# EAGLE design rocketSoldering (EAGLE 7.3.0)
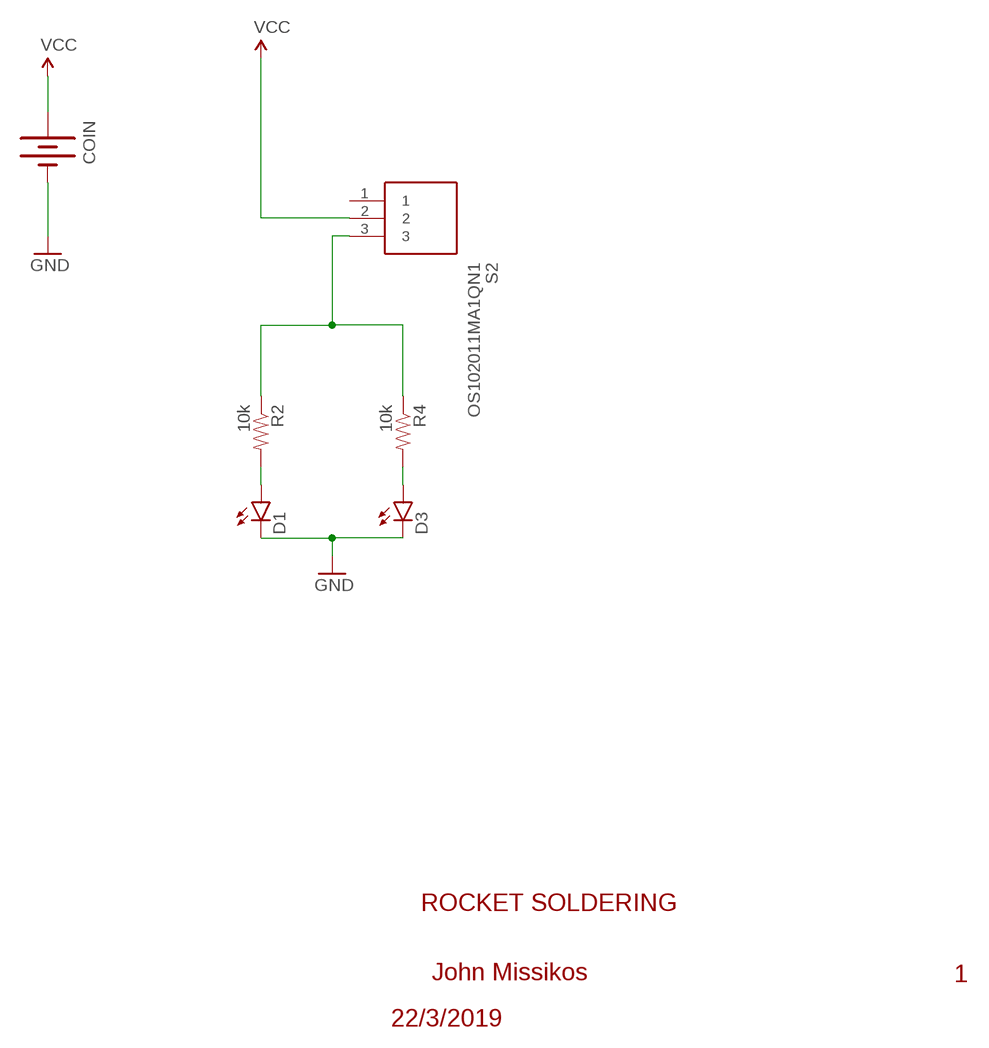
[diagram p0: schematic, sheet 1]

## Parts
COIN  BATTERY_20MM20PTH  [BATTCOM_20MM_PTH]
D1  LED5MM  [LED5MM]
D3  LED5MM  [LED5MM]
R2  10k  RESISTORAXIAL-0.3  [AXIAL-0.3]
R4  10k  RESISTORAXIAL-0.3  [AXIAL-0.3]
S2  OS102011MA1QN1  [OS102011MA1QN1]

## Nets
GND: COIN.2(-) D1.K(C) D3.K(C)
N$1: D1.A R2.P$2
N$2: R2.P$1 R4.P$1 S2.3
N$5: D3.A R4.P$2
VCC: COIN.1(+) S2.2
Unconnected: S2.1

## Notes on the sheet
- ROCKET SOLDERING
- John Missikos | 1
- 22/3/2019

## Library data of the parts
COIN = TinkerElectric:BATTERY_20MM: Battery Holders Various common sizes : AA, AAA, 18650 (PRT-12895), 20mm coin cell and 12mm coin cell. 20MM_4LEGS, BATT-10373
D1 D3 = SparkFun-LED:LED: LEDs Standard schematic elements and footprints for 5mm, 3mm, 1206, and 0603 sized LEDs. 5mm - Spark Fun Electronics SKU : COM-00529 (and others)
R2 R4 = SparkFun-Passives:RESISTOR: Resistor Basic schematic elements and footprints for 0603, 1206, and PTH resistors.
S2 = TinkerElectric:OS102011MA1QN1: Switch Slide Right Angle SPDT 0.1A 12VDC Through Hole Slide Switch SPDT On-On 0.1 A@ 12 V dc Slide Source: Datasheet <http://www.ckswitches.com/media/1428/os.pdf>; ALLIED_NUMBER: 70128246; ALLIED_PRICE-STOCK: https://www.alliedelec.com/c-k-os102011ma1qn1/70128246/; DESCRIPTION: Switch Slide Right Angle SPDT 0.1A 12VDC Through Hole Slide Switch SPDT On-On 0.1 A@ 12 V dc Slide; HEIGHT: mm; MANUFACTURER_NAME: C & K COMPONENTS; MANUFACTURER_PART_NUMBER: OS102011MA1QN1; MOUSER_PART_NUMBER: 611-OS102011MA1QN1; MOUSER_PRICE-STOCK: https://www.mouser.com/Search/Refine.aspx?Keyword=611-OS102011MA1QN1; RS_PART_NUMBER: 7874855; RS_PRICE-STOCK: http://uk.rs-online.com/web/p/products/7874855

## Board
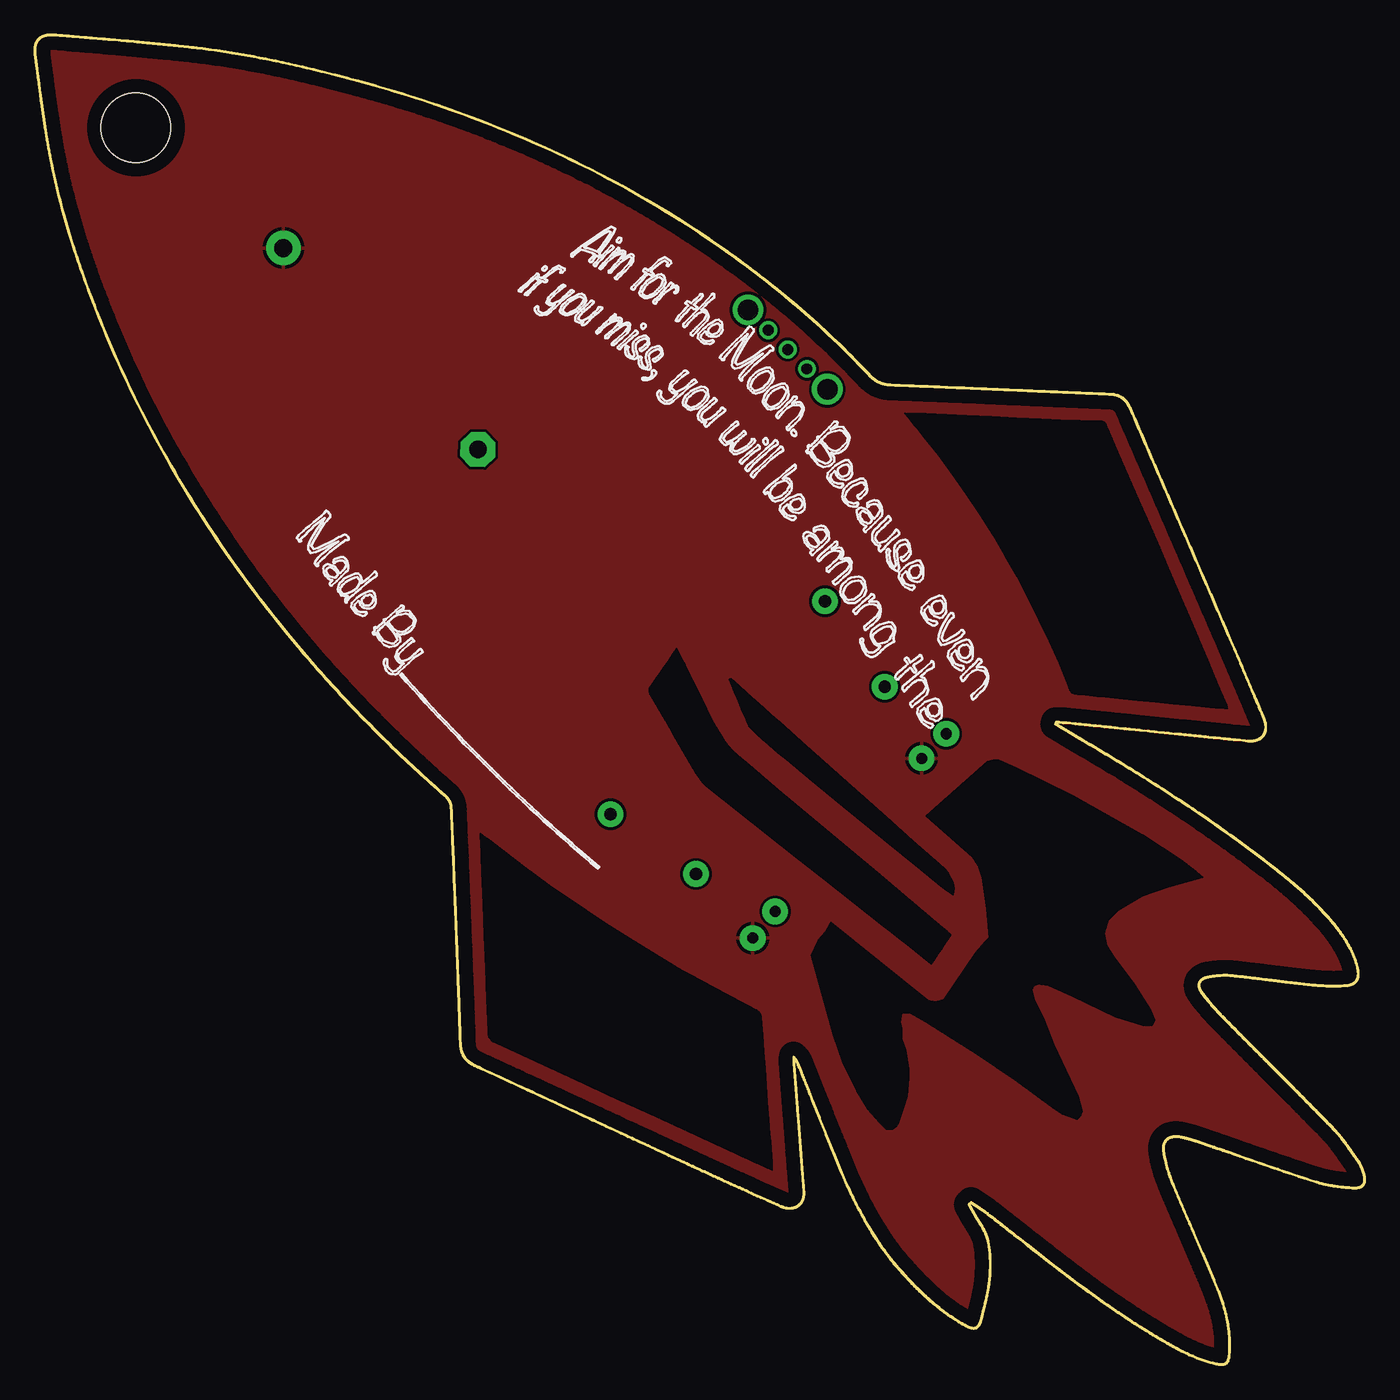
[diagram p1: board, top side]
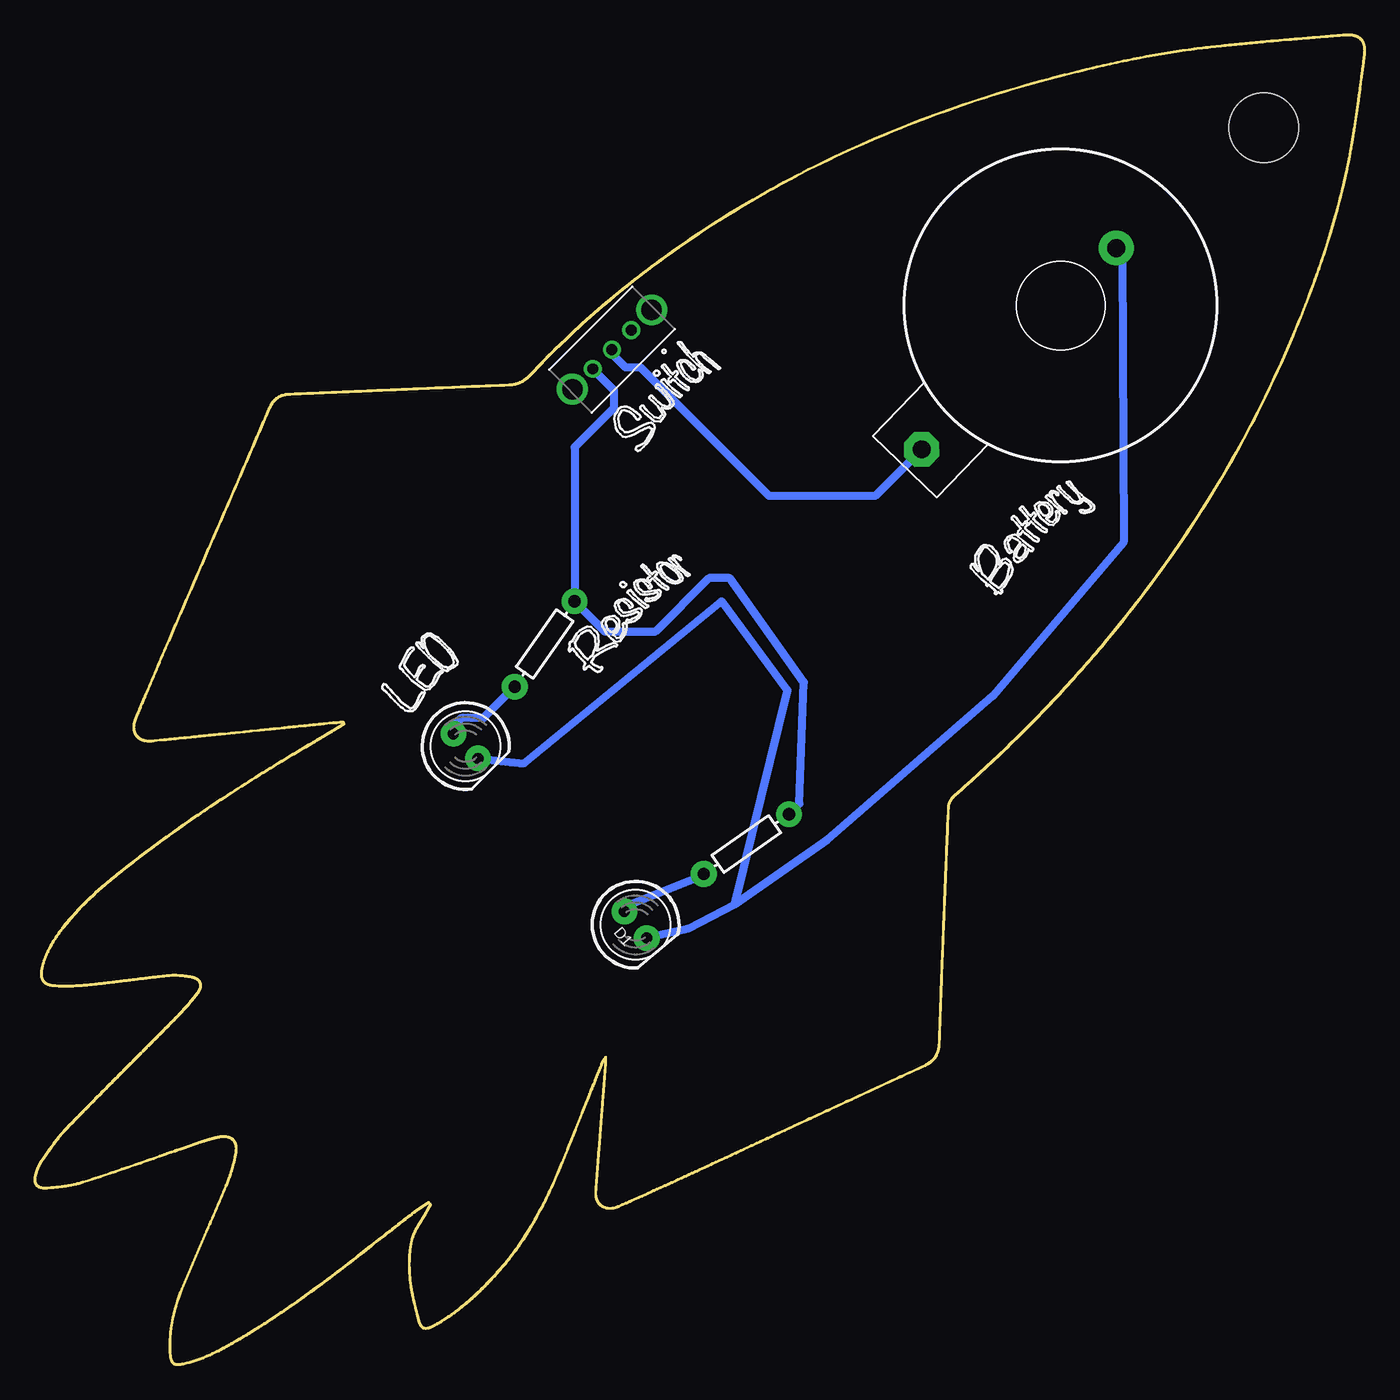
[diagram p2: board, bottom side, seen from below]

Size 97.3 x 97.33 mm. Coordinates in mm from the lower left corner, seen from the top.
Outline: 10828 segments
Copper layers (1*16): Top 0.035mm / dielectric 1.5mm / Bottom 0.035mm
Design rules "default": minimum track width 10mil, minimum drill 24mil, track to track 8mil, track to pad 8mil, pad to pad 8mil, via to via 8mil, smd to smd 8mil, copper to edge 40mil, drill to drill 8mil, minimum pad ring 10mil, minimum via ring 8mil, stop-mask expansion 4mil, vias tented up to drill 0mil, thermal gap 10mil
Holes 5.08 mm at 7.43,90.49
tRestrict: area 32.6,14.3 to 54,38.9; area 63.6,48 to 87.2,69.6; area 45,29.4 to 67,52.4; area 50.8,34.4 to 67.2,50.2; area 56.8,17.3 to 85.4,44.3

### Footprints (pad centres in the part's own frame; a part is rotated, then mirrored left to right if it is on the bottom)
BATTCOM_20MM_PTH = drill 1.3 pad 2.54 octagon: 1 14.63,0 | drill 1.3 pad 2.54: 2 -5.842,0
LED5MM = drill 0.813 pad 1.88: A -1.27,0; K 1.27,0
AXIAL-0.3 = drill 0.9 pad 1.88: P$1 -3.81,0; P$2 3.81,0
OS102011MA1QN1 = drill 0.8 pad 1.3: 1 -2,0; 2 0,0; 3 2,0 | drill 1.5 pad 2.25: 4 -4.1,0; 5 4.1,0

### Placement (x,y rotation side)
COIN  22.27,77.49 226 bottom
D1  53.34,32.21 310 bottom
D3  65.76,45.28 315 bottom
R2  45.24,38.12 215 bottom
R4  59.99,52.74 235 bottom
S2  55.07,74.27 225 bottom

### Tracks (layer width: path | path; a pad name or v marks a point on that pad's centre or on a via)
GND
  Bottom 0.6: COIN.2 17.76,81.24 17.67,60.18 27.24,48.92 39.35,38.43 46.14,33.66 | 46.14,33.66 49.49,31.92 D1.K | D3.K 61.5,44.01 47.05,55.87 42.24,49.36 46.14,33.66
  pour Top: -0.19,96.5 1.93,82.36 9.38,64.84 17.33,53.75 28.17,41.81 30.03,40.37 31.13,22.26 55.18,11.17 59.16,12.44 63.47,4.9 68.72,1.77 70.75,2.28 70.84,9.47 82.52,0.75 86.84,-0.18 87.35,0.16 91.5,13.37 96.57,12.77 97.34,13.11 97.51,14.13 88.19,27.34 96.49,27.59 97.17,28.77 95.56,32.08 84.38,45.2 89.38,45.37 90.39,46.47 79.81,71.53 62.46,72.2 52.13,81.09 41.04,87.78 33.76,91.17 25.12,93.96 17.25,95.74 11.75,96.67 6.67,97.18 1.16,97.43 0.4,97.26 0.06,97.01
N$1
  Bottom 0.254: 48.36,35.4 R2.P$2
  Bottom 0.6: 48.36,35.4 48.68,35.72 53.74,33.68 54.16,33.77 D1.A
N$2
  Bottom 0.254: 57.68,55.86 R4.P$1 | 41.8,40.62 41.38,41.05
  Bottom 0.6: S2.3 54.92,71.3 54.92,70 57.8,67.13 R4.P$1 55.6,53.66 51.87,53.66 47.99,57.55 46.45,57.55 41.04,49.94 41.38,41.05 | R2.P$1 41.8,40.62
N$5
  Bottom 0.6: R4.P$2 64.47,47.31 66.1,47.31 66.66,46.76 D3.A
VCC
  Bottom 0.6: COIN.1 35.83,63.57 43.58,63.57 52.98,72.97 54.08,72.97 55.07,73.96 S2.2